# Altium project 开关电源.PrjPCB
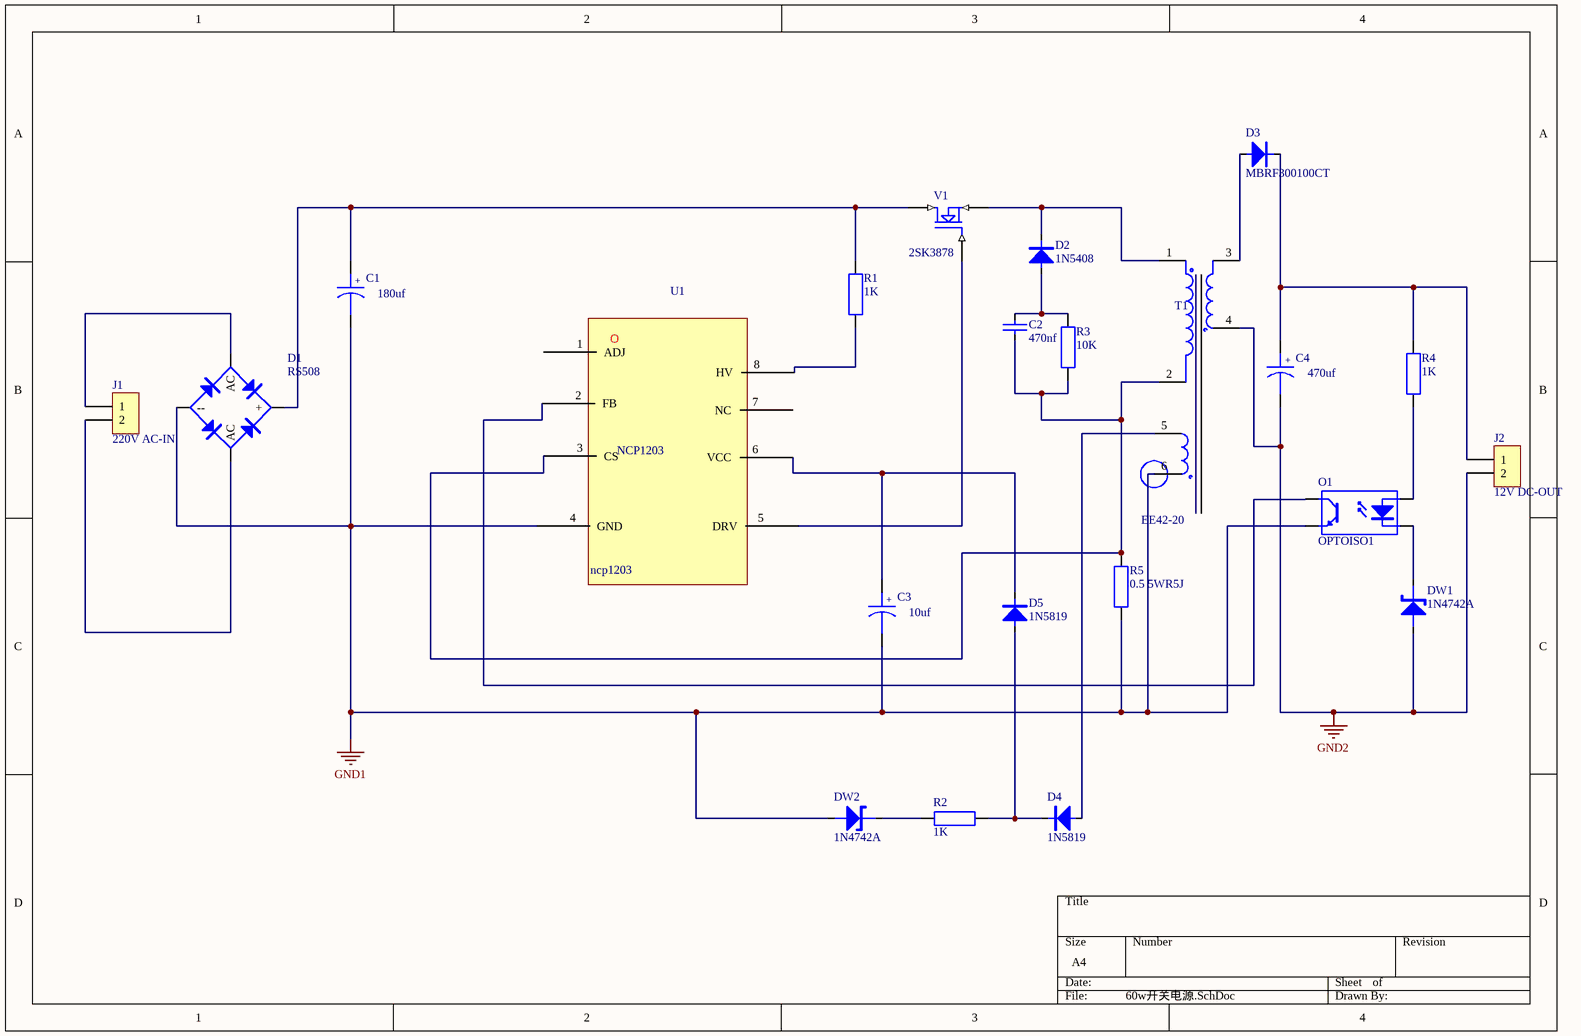
[diagram p0: 60w开关电源.SchDoc]
1 sheet, 22 parts. Net scope: global (net labels, ports and power ports of the same name join across sheets).
Board file: 60W开关电源.PcbDoc

## Sheet 60w开关电源.SchDoc
size A4

### Parts
C1  180uf  [180uf]
C2  470nf  [CAP 474J]
C3  10uf  [CAP_D5MM]
C4  470uf  [CAP_D8MM]
D1  RS508  [RS508]
D2  1N5408  [DO-27]
D3  MBRF300100CT  [mbrf30100ct]
D4  1N5819  [DO-41]
D5  1N5819  [DO-41]
DW1  1N4742A  [DO-41]
DW2  1N4742A  [do-41]
J1  220V AC-IN  [3pin]
J2  12V DC-OUT  [3PIN]
O1  OPTOISO1  [PC817]
R1  1K  [axial0.4]
R2  1K  [axial0.4]
R3  10K  [axial0.4]
R4  1K  [axial0.4]
R5  0.5 5WR5J  [5wr5j]
T1  EE42-20  [ee4220]
U1  ncp1203  [NCP1203]
V1  2SK3878  [to-3p]

### Nets
GND1: C1.2 C3.2 D1.4(--) DW2.1 O1.3 R5.1 T1.6(sec+) U1.4(GND)
GND2: C4.2 DW1.1 J2.2 T1.4(Sec+)
NetC1_1: C1.1 D1.1(+) R1.2 V1.2(D)
NetC2_1: C2.1 D2.1 R3.2
NetC2_2: C2.2 R3.1 R5.2 T1.2(Pri-) U1.3(CS)
NetC3_1: C3.1 D5.2 U1.6(VCC)
NetC4_1: C4.1 D3.2 J2.1 R4.2
NetD1_2: D1.2(AC) J1.1
NetD1_3: D1.3(AC) J1.2
NetD2_2: D2.2 T1.1(Pri+) V1.3(S)
NetD3_1: D3.1 T1.3(Sec-)
NetD4_1: D4.1 T1.5(sec-)
NetD4_2: D4.2 D5.1 R2.1
NetDW1_2: DW1.2 O1.2
NetDW2_2: DW2.2 R2.2
NetO1_1: O1.1 R4.1
NetO1_4: O1.4 U1.2(FB)
NetR1_1: R1.1 U1.8(HV)
NetU1_5: U1.5(DRV) V1.1(G)

Not connected (* = marked no-connect by the designer): U1 1(ADJ) 7(NC)

### Notes on the sheet
- (in symbol CAPACITOR POL) +
- (in symbol ncp1203) NCP1203

### Library data of the parts
C1 C3 C4 = CAPACITOR POL: Capacitor
C2 = CAP
D1 = BRIDGE1
D2-D5 = DIODE
DW1 DW2 = ZENER2
J1 J2 = CON2: Connector
R1-R5 = RES
T1 = 变压器
V1 = MOSFET N